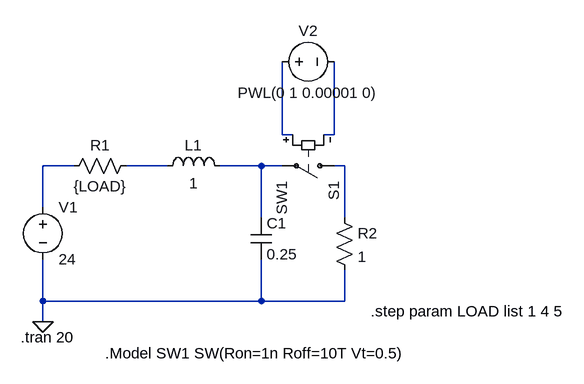
[diagram p0: schematic jalase-2.asc]
jalase-2.asc, the LTspice schematic file:
Version 4
SHEET 1 968 680
WIRE 512 16 512 -96
WIRE 528 16 512 16
WIRE 592 16 592 -96
WIRE 592 16 576 16
WIRE 192 64 144 64
WIRE 336 64 272 64
WIRE 480 64 416 64
WIRE 512 64 480 64
WIRE 608 64 592 64
WIRE 144 128 144 64
WIRE 480 144 480 64
WIRE 608 144 608 64
WIRE 144 272 144 208
WIRE 480 272 480 208
WIRE 480 272 144 272
WIRE 608 272 608 224
WIRE 608 272 480 272
WIRE 144 304 144 272
FLAG 144 304 0
SYMBOL voltage 144 112 R0
WINDOW 123 0 0 Left 0
WINDOW 39 0 0 Left 0
SYMATTR InstName V1
SYMATTR Value 24
SYMBOL res 288 48 R90
WINDOW 0 0 56 VBottom 2
WINDOW 3 32 56 VTop 2
SYMATTR InstName R1
SYMATTR Value {LOAD}
SYMBOL ind 320 80 R270
WINDOW 0 32 56 VTop 2
WINDOW 3 5 56 VBottom 2
SYMATTR InstName L1
SYMATTR Value 1
SYMBOL cap 464 144 R0
SYMATTR InstName C1
SYMATTR Value 0.25
SYMBOL res 592 128 R0
SYMATTR InstName R2
SYMATTR Value 1
SYMBOL sw 608 64 R90
SYMATTR InstName S1
SYMATTR Value SW1
SYMBOL voltage 496 -96 R270
WINDOW 0 32 56 VTop 2
WINDOW 3 -32 56 VBottom 2
WINDOW 123 0 0 Left 0
WINDOW 39 0 0 Left 0
SYMATTR InstName V2
SYMATTR Value PWL(0 1 0.00001 0)
TEXT 110 328 Left 2 !.tran 20
TEXT 240 352 Left 2 !.Model SW1 SW(Ron=1n Roff=10T Vt=0.5)
TEXT 648 288 Left 2 !.step param LOAD list 1 4 5

The netlist it stands for:
* jalase-2.asc
V1 N003 0 24
R1 N004 N003 {LOAD}
L1 N004 N005 1
C1 N005 0 0.25
R2 N006 0 1
S1 N006 N005 N001 N002 SW1
V2 N001 N002 PWL(0 1 0.00001 0)
.tran 20
.Model SW1 SW(Ron=1n Roff=10T Vt=0.5)
.step param LOAD list 1 4 5
.backanno
.end